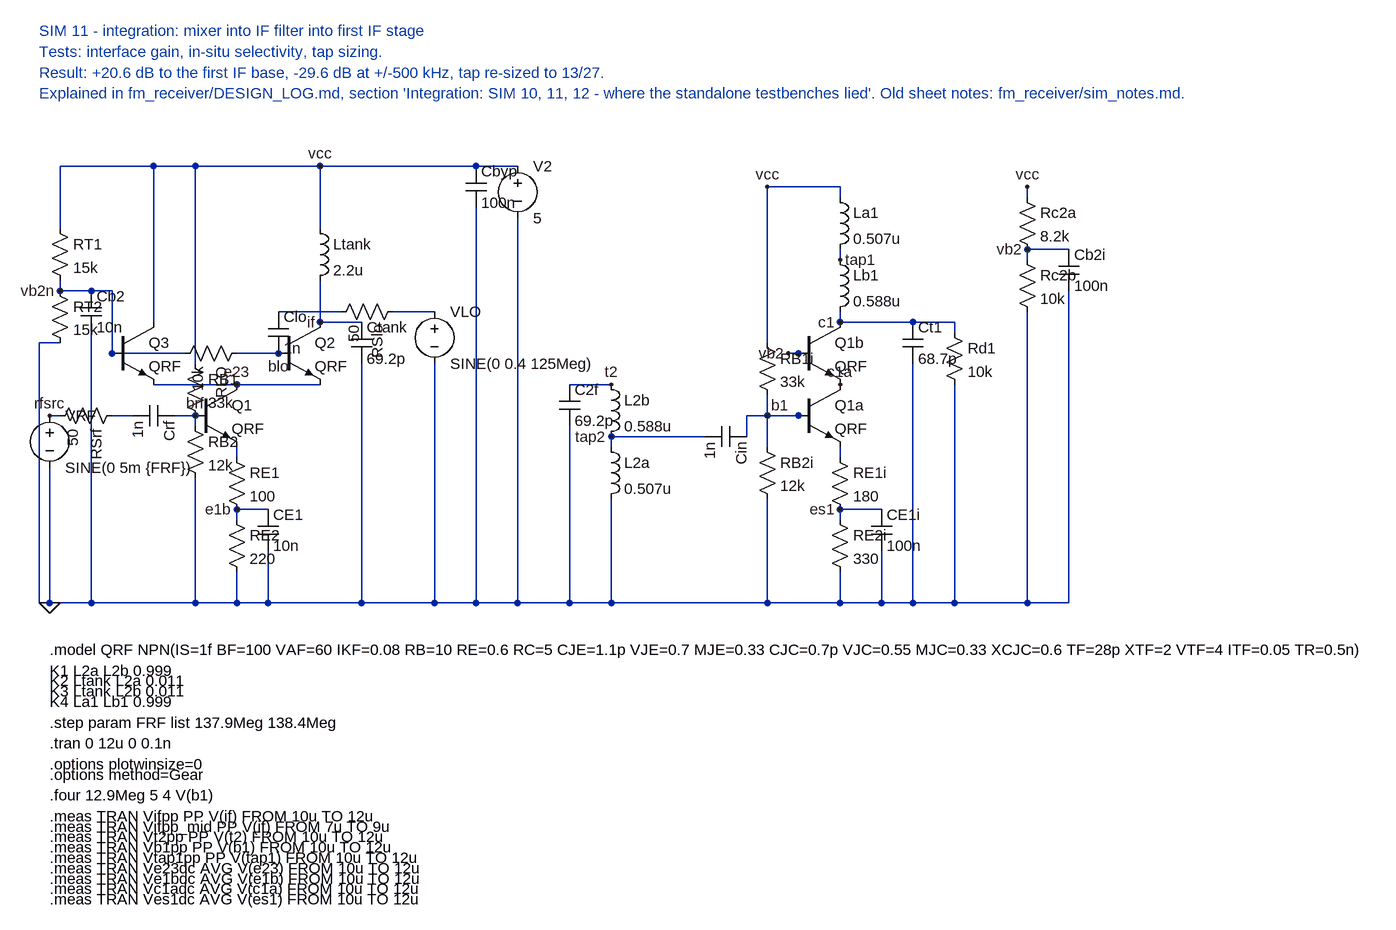
[diagram p0: schematic sim11_mixer_filter_if.asc]
sim11_mixer_filter_if.asc, the LTspice schematic file:
Version 4
SHEET 1 2000 1100
WIRE 64 16 208 16
WIRE 208 16 272 16
WIRE 272 16 464 16
WIRE 464 16 704 16
WIRE 704 16 768 16
WIRE 64 112 64 16
WIRE 208 256 208 16
WIRE 272 320 272 16
WIRE 464 112 464 16
WIRE 64 192 64 208
WIRE 64 288 32 288
WIRE 32 288 32 688
WIRE 32 688 48 688
WIRE 64 208 112 208
WIRE 112 208 144 208
WIRE 144 208 144 304
WIRE 112 272 112 688
WIRE 144 304 256 304
WIRE 336 304 400 304
WIRE 400 240 496 240
WIRE 576 240 640 240
WIRE 640 320 640 688
WIRE 464 192 464 256
WIRE 464 256 528 256
WIRE 528 320 528 688
WIRE 208 352 336 352
WIRE 336 352 464 352
WIRE 48 400 64 400
WIRE 144 400 176 400
WIRE 240 400 272 400
WIRE 272 400 272 416
WIRE 272 496 272 688
WIRE 336 448 336 464
WIRE 336 544 336 560
WIRE 336 544 384 544
WIRE 336 640 336 688
WIRE 384 608 384 688
WIRE 48 480 48 688
WIRE 48 688 112 688
WIRE 112 688 272 688
WIRE 272 688 336 688
WIRE 336 688 384 688
WIRE 384 688 528 688
WIRE 528 688 640 688
WIRE 640 688 704 688
WIRE 704 80 704 688
WIRE 768 96 768 688
WIRE 704 688 768 688
WIRE 848 352 912 352
WIRE 848 416 848 688
WIRE 912 432 912 448
WIRE 912 432 1056 432
WIRE 912 528 912 688
WIRE 1120 400 1120 432
WIRE 1120 400 1152 400
WIRE 1152 48 1264 48
WIRE 1152 48 1152 288
WIRE 1264 48 1264 64
WIRE 1264 144 1264 160
WIRE 1264 240 1264 256
WIRE 1264 256 1376 256
WIRE 1376 256 1440 256
WIRE 1440 256 1440 272
WIRE 1440 352 1440 688
WIRE 1376 320 1376 688
WIRE 1152 368 1152 448
WIRE 1152 400 1216 400
WIRE 1184 304 1216 304
WIRE 1152 528 1152 688
WIRE 1264 448 1264 464
WIRE 1264 544 1264 560
WIRE 1264 544 1328 544
WIRE 1264 640 1264 688
WIRE 1328 608 1328 688
WIRE 1552 48 1552 64
WIRE 1552 144 1552 160
WIRE 1552 144 1616 144
WIRE 1552 240 1552 688
WIRE 1616 208 1616 688
WIRE 768 688 848 688
WIRE 848 688 912 688
WIRE 912 688 1152 688
WIRE 1152 688 1264 688
WIRE 1264 688 1328 688
WIRE 1328 688 1376 688
WIRE 1376 688 1440 688
WIRE 1440 688 1552 688
WIRE 1552 688 1616 688
FLAG 48 688 0
FLAG 464 16 vcc
FLAG 1152 48 vcc
FLAG 1552 48 vcc
FLAG 48 400 rfsrc
FLAG 272 400 brf
FLAG 64 208 vb2n
FLAG 400 304 blo
FLAG 336 352 e23
FLAG 464 256 if
FLAG 336 544 e1b
FLAG 912 352 t2
FLAG 912 432 tap2
FLAG 1152 400 b1
FLAG 1184 304 vb2
FLAG 1552 144 vb2
FLAG 1264 160 tap1
FLAG 1264 256 c1
FLAG 1264 352 c1a
FLAG 1264 544 es1
SYMBOL voltage 48 384 R0
SYMATTR InstName VRF
SYMATTR Value SINE(0 5m {FRF})
SYMBOL res 160 384 R90
SYMATTR InstName RSrf
SYMATTR Value 50
SYMBOL cap 240 384 R90
SYMATTR InstName Crf
SYMATTR Value 1n
SYMBOL res 256 304 R0
SYMATTR InstName RB1
SYMATTR Value 33k
SYMBOL res 256 400 R0
SYMATTR InstName RB2
SYMATTR Value 12k
SYMBOL npn 272 352 R0
SYMATTR InstName Q1
SYMATTR Value QRF
SYMBOL res 320 448 R0
SYMATTR InstName RE1
SYMATTR Value 100
SYMBOL res 320 544 R0
SYMATTR InstName RE2
SYMATTR Value 220
SYMBOL cap 368 544 R0
SYMATTR InstName CE1
SYMATTR Value 10n
SYMBOL res 48 96 R0
SYMATTR InstName RT1
SYMATTR Value 15k
SYMBOL res 48 192 R0
SYMATTR InstName RT2
SYMATTR Value 15k
SYMBOL cap 96 208 R0
SYMATTR InstName Cb2
SYMATTR Value 10n
SYMBOL npn 144 256 R0
SYMATTR InstName Q3
SYMATTR Value QRF
SYMBOL npn 400 256 R0
SYMATTR InstName Q2
SYMATTR Value QRF
SYMBOL res 352 288 R90
SYMATTR InstName RLO
SYMATTR Value 10k
SYMBOL cap 384 240 R0
SYMATTR InstName Clo
SYMATTR Value 1n
SYMBOL res 592 224 R90
SYMATTR InstName RSlo
SYMATTR Value 50
SYMBOL voltage 640 224 R0
SYMATTR InstName VLO
SYMATTR Value SINE(0 0.4 125Meg)
SYMBOL ind 448 96 R0
SYMATTR InstName Ltank
SYMATTR Value 2.2u
SYMATTR SpiceLine Rser=1
SYMBOL cap 512 256 R0
SYMATTR InstName Ctank
SYMATTR Value 69.2p
SYMBOL cap 688 16 R0
SYMATTR InstName Cbyp
SYMATTR Value 100n
SYMBOL voltage 768 0 R0
SYMATTR InstName V2
SYMATTR Value 5
SYMBOL cap 832 352 R0
SYMATTR InstName C2f
SYMATTR Value 69.2p
SYMBOL ind 896 336 R0
SYMATTR InstName L2b
SYMATTR Value 0.588u
SYMATTR SpiceLine Rser=0.5
SYMBOL ind 896 432 R0
SYMATTR InstName L2a
SYMATTR Value 0.507u
SYMATTR SpiceLine Rser=0.5
SYMBOL cap 1120 416 R90
SYMATTR InstName Cin
SYMATTR Value 1n
SYMBOL res 1136 272 R0
SYMATTR InstName RB1i
SYMATTR Value 33k
SYMBOL res 1136 432 R0
SYMATTR InstName RB2i
SYMATTR Value 12k
SYMBOL npn 1200 256 R0
SYMATTR InstName Q1b
SYMATTR Value QRF
SYMBOL npn 1200 352 R0
SYMATTR InstName Q1a
SYMATTR Value QRF
SYMBOL ind 1248 48 R0
SYMATTR InstName La1
SYMATTR Value 0.507u
SYMBOL ind 1248 144 R0
SYMATTR InstName Lb1
SYMATTR Value 0.588u
SYMBOL cap 1360 256 R0
SYMATTR InstName Ct1
SYMATTR Value 68.7p
SYMBOL res 1424 256 R0
SYMATTR InstName Rd1
SYMATTR Value 10k
SYMBOL res 1248 448 R0
SYMATTR InstName RE1i
SYMATTR Value 180
SYMBOL res 1248 544 R0
SYMATTR InstName RE2i
SYMATTR Value 330
SYMBOL cap 1312 544 R0
SYMATTR InstName CE1i
SYMATTR Value 100n
SYMBOL res 1536 48 R0
SYMATTR InstName Rc2a
SYMATTR Value 8.2k
SYMBOL res 1536 144 R0
SYMATTR InstName Rc2b
SYMATTR Value 10k
SYMBOL cap 1600 144 R0
SYMATTR InstName Cb2i
SYMATTR Value 100n
TEXT 48 760 Left 2 !.model QRF NPN(IS=1f BF=100 VAF=60 IKF=0.08 RB=10 RE=0.6 RC=5 CJE=1.1p VJE=0.7 MJE=0.33 CJC=0.7p VJC=0.55 MJC=0.33 XCJC=0.6 TF=28p XTF=2 VTF=4 ITF=0.05 TR=0.5n)
TEXT 48 792 Left 2 !K1 L2a L2b 0.999
TEXT 48 808 Left 2 !K2 Ltank L2a 0.011
TEXT 48 824 Left 2 !K3 Ltank L2b 0.011
TEXT 48 840 Left 2 !K4 La1 Lb1 0.999
TEXT 48 872 Left 2 !.step param FRF list 137.9Meg 138.4Meg
TEXT 48 904 Left 2 !.tran 0 12u 0 0.1n
TEXT 48 936 Left 2 !.options plotwinsize=0
TEXT 48 952 Left 2 !.options method=Gear
TEXT 48 984 Left 2 !.four 12.9Meg 5 4 V(b1)
TEXT 48 1016 Left 2 !.meas TRAN Vifpp PP V(if) FROM 10u TO 12u
TEXT 48 1032 Left 2 !.meas TRAN Vifpp_mid PP V(if) FROM 7u TO 9u
TEXT 48 1048 Left 2 !.meas TRAN Vt2pp PP V(t2) FROM 10u TO 12u
TEXT 48 1064 Left 2 !.meas TRAN Vb1pp PP V(b1) FROM 10u TO 12u
TEXT 48 1080 Left 2 !.meas TRAN Vtap1pp PP V(tap1) FROM 10u TO 12u
TEXT 48 1096 Left 2 !.meas TRAN Ve23dc AVG V(e23) FROM 10u TO 12u
TEXT 48 1112 Left 2 !.meas TRAN Ve1bdc AVG V(e1b) FROM 10u TO 12u
TEXT 48 1128 Left 2 !.meas TRAN Vc1adc AVG V(c1a) FROM 10u TO 12u
TEXT 48 1144 Left 2 !.meas TRAN Ves1dc AVG V(es1) FROM 10u TO 12u
TEXT 32 -192 Left 2 ;SIM 11 - integration: mixer into IF filter into first IF stage
TEXT 32 -160 Left 2 ;Tests: interface gain, in-situ selectivity, tap sizing.
TEXT 32 -128 Left 2 ;Result: +20.6 dB to the first IF base, -29.6 dB at +/-500 kHz, tap re-sized to 13/27.
TEXT 32 -96 Left 2 ;Explained in fm_receiver/DESIGN_LOG.md, section 'Integration: SIM 10, 11, 12 - where the standalone testbenches lied'. Old sheet notes: fm_receiver/sim_notes.md.

The netlist it stands for:
* sim11_mixer_filter_if.asc
VRF rfsrc 0 SINE(0 5m {FRF})
RSrf N003 rfsrc 50
Crf brf N003 1n
RB1 vcc brf 33k
RB2 brf 0 12k
Q1 e23 brf N004 0 QRF
RE1 N004 e1b 100
RE2 e1b 0 220
CE1 e1b 0 10n
RT1 vcc vb2n 15k
RT2 vb2n 0 15k
Cb2 vb2n 0 10n
Q3 vcc vb2n e23 0 QRF
Q2 if blo e23 0 QRF
RLO blo vb2n 10k
Clo N001 blo 1n
RSlo N002 N001 50
VLO N002 0 SINE(0 0.4 125Meg)
Ltank vcc if 2.2u Rser=1
Ctank if 0 69.2p
Cbyp vcc 0 100n
V2 vcc 0 5
C2f t2 0 69.2p
L2b t2 tap2 0.588u Rser=0.5
L2a tap2 0 0.507u Rser=0.5
Cin b1 tap2 1n
RB1i vcc b1 33k
RB2i b1 0 12k
Q1b c1 vb2 c1a 0 QRF
Q1a c1a b1 N005 0 QRF
La1 vcc tap1 0.507u
Lb1 tap1 c1 0.588u
Ct1 c1 0 68.7p
Rd1 c1 0 10k
RE1i N005 es1 180
RE2i es1 0 330
CE1i es1 0 100n
Rc2a vcc vb2 8.2k
Rc2b vb2 0 10k
Cb2i vb2 0 100n
.model NPN NPN
.model PNP PNP
.lib standard.bjt
.model QRF NPN(IS=1f BF=100 VAF=60 IKF=0.08 RB=10 RE=0.6 RC=5 CJE=1.1p VJE=0.7 MJE=0.33 CJC=0.7p VJC=0.55 MJC=0.33 XCJC=0.6 TF=28p XTF=2 VTF=4 ITF=0.05 TR=0.5n)
K1 L2a L2b 0.999
K2 Ltank L2a 0.011
K3 Ltank L2b 0.011
K4 La1 Lb1 0.999
.step param FRF list 137.9Meg 138.4Meg
.tran 0 12u 0 0.1n
.options plotwinsize=0
.options method=Gear
.four 12.9Meg 5 4 V(b1)
.meas TRAN Vifpp PP V(if) FROM 10u TO 12u
.meas TRAN Vifpp_mid PP V(if) FROM 7u TO 9u
.meas TRAN Vt2pp PP V(t2) FROM 10u TO 12u
.meas TRAN Vb1pp PP V(b1) FROM 10u TO 12u
.meas TRAN Vtap1pp PP V(tap1) FROM 10u TO 12u
.meas TRAN Ve23dc AVG V(e23) FROM 10u TO 12u
.meas TRAN Ve1bdc AVG V(e1b) FROM 10u TO 12u
.meas TRAN Vc1adc AVG V(c1a) FROM 10u TO 12u
.meas TRAN Ves1dc AVG V(es1) FROM 10u TO 12u
* SIM 11 - integration: mixer into IF filter into first IF stage
* Tests: interface gain, in-situ selectivity, tap sizing.
* Result: +20.6 dB to the first IF base, -29.6 dB at +/-500 kHz, tap re-sized to 13/27.
* Explained in fm_receiver/DESIGN_LOG.md, section 'Integration: SIM 10, 11, 12 - where the standalone testbenches lied'. Old sheet notes: fm_receiver/sim_notes.md.
.backanno
.end